# EAGLE design rs485 (EAGLE 6.5.0)
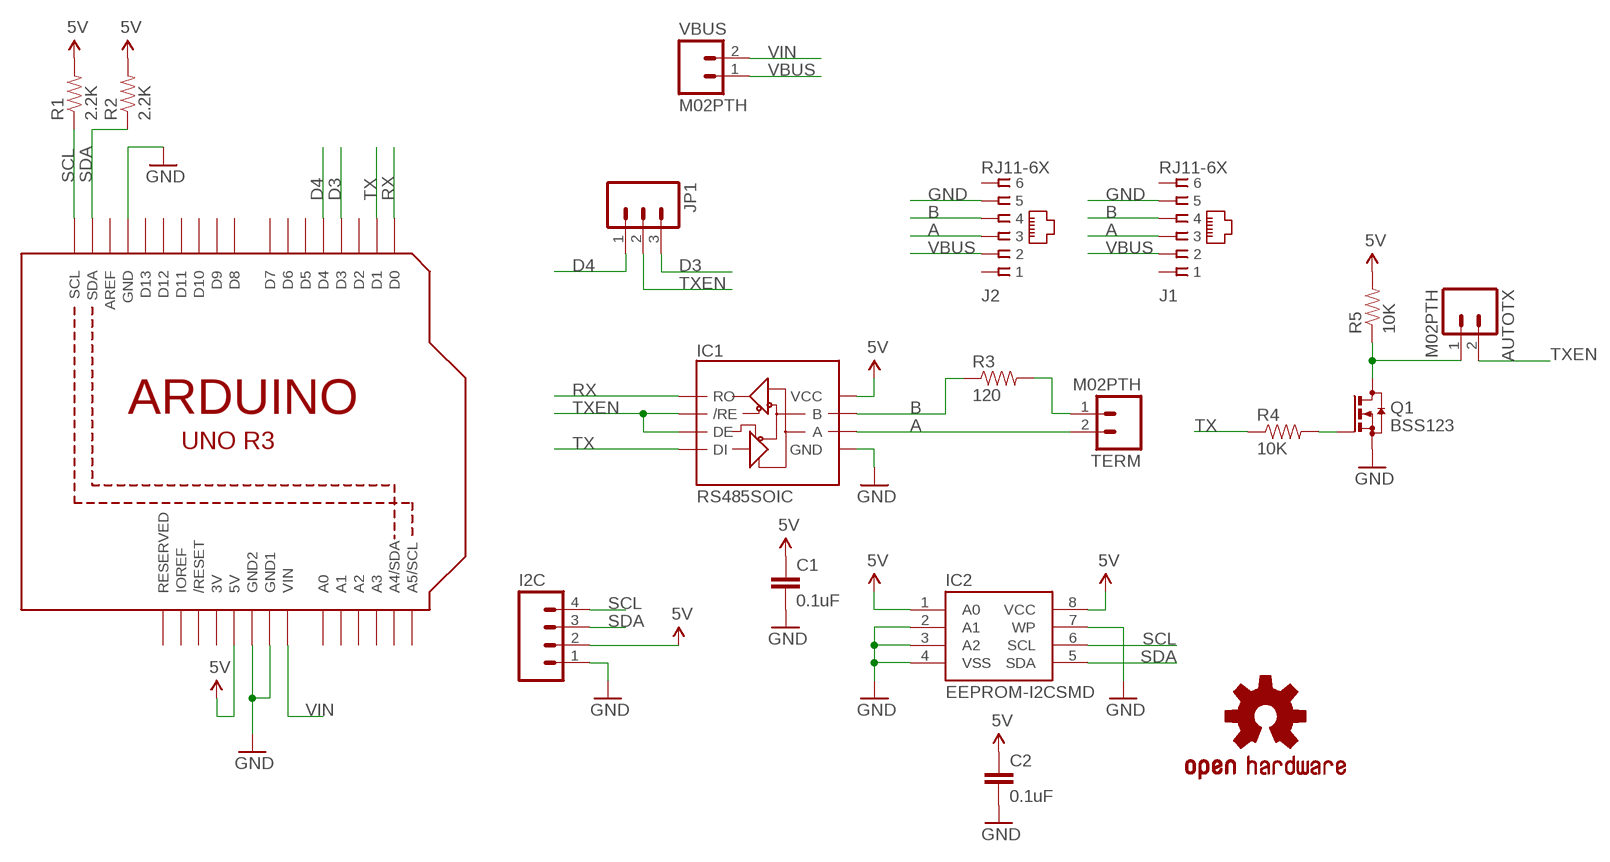
[diagram p0: schematic, sheet 1]

## Parts
AUTOTX  M02PTH  [1X02]
C1  0.1uF  CAP0603-CAP  [0603-CAP]
C2  0.1uF  CAP0603-CAP  [0603-CAP]
I2C  M04PTH  [1X04]
IC1  RS485SOIC  [SO08]
IC2  EEPROM-I2CSMD  [SO08]
J1  RJ11-6X  [RJ11-NO_SHIELD]
J2  RJ11-6X  [RJ11-NO_SHIELD]
JP1  M03PTH  [1X03]
LOGO1  OSHW-LOGOL  [OSHW-LOGO-L]
Q1  BSS123  [SOT23]
R1  2.2K  RESISTOR0603-RES  [0603-RES]
R2  2.2K  RESISTOR0603-RES  [0603-RES]
R3  120  RESISTOR0603-RES  [0603-RES]
R4  10K  RESISTOR0603-RES  [0603-RES]
R5  10K  RESISTOR0603-RES  [0603-RES]
TERM  M02PTH  [1X02]
U1  ARDUINOR3-JUSTPINS  [ARDUINOR3]
VBUS  M02PTH  [1X02]

## Nets
5V: C1.1 C2.1 I2C.2 IC1.8(VCC) IC2.1(A0) IC2.8(VCC) R1.2 R2.2 R5.2 U1.5V
A: IC1.6(A) J1.3 J2.3 TERM.2
B: IC1.7(B) J1.4 J2.4 R3.1
D3: JP1.3 U1.D3
D4: JP1.1 U1.D4
GND: C1.2 C2.2 I2C.1 IC1.5(GND) IC2.2(A1) IC2.3(A2) IC2.4(VSS) IC2.7(WP) J1.5 J2.5 Q1.2(S) U1.GND U1.GND1 U1.GND2
N$1: R3.2 TERM.1
N$2: AUTOTX.1 Q1.3(D) R5.1
N$3: Q1.1(G) R4.2
RX: IC1.1(RO) U1.D0
SCL: I2C.4 IC2.6(SCL) R1.1 U1.SCL
SDA: I2C.3 IC2.5(SDA) R2.1 U1.SDA
TX: IC1.4(DI) R4.1 U1.D1
TXEN: AUTOTX.2 IC1.2(/RE) IC1.3(DE) JP1.2
VBUS: J1.2 J2.2 VBUS.1
VIN: U1.VIN VBUS.2
Unconnected: J1.1 J1.6 J2.1 J2.6 U1.A0 U1.A1 U1.A2 U1.A3 U1.A4(A4/SDA) U1.A5(A5/SCL) U1.AREF U1.D2 U1.D5 U1.D6 U1.D7 U1.D8 U1.D9 U1.D10 U1.D11 U1.D12 U1.D13 U1.IOREF U1.RESERVED U1.RESET(/RESET)

## Power pins joined to a net without a drawn wire
3V: U1.3V

## Library data of the parts
AUTOTX TERM VBUS = SparkFun-Connectors:M02: Standard 2-pin 0.1" header. Use with - straight break away headers ( PRT-00116) - right angle break away headers (PRT-00553) - swiss pins (PRT-00743) - machine pins (PRT-00117) - female headers (PRT-00115) Molex polarized connector foot print use with: PRT-08233 with associated crimp pins and housings. 2.54_SCREWTERM for use with PRT-10571. 3.5mm Screw Terminal footprints for PRT-08084 5mm Screw Terminal footprints for use with PRT-08433
C1 C2 = SparkFun-Passives:CAP: Capacitor Standard 0603 ceramic capacitor, and 0.1" leaded capacitor.
I2C = SparkFun-Connectors:M04: Header 4 Standard 4-pin 0.1" header. Use with straight break away headers (SKU : PRT-00116), right angle break away headers (PRT-00553), swiss pins (PRT-00743), machine pins (PRT-00117), and female headers (PRT-00115). Molex polarized connector foot print use with SKU : PRT-08231 with associated crimp pins and housings. 1MM SMD Version SKU: PRT-10208
IC1 = SparkFun-DigitalIC:RS485: RS485 transceiver
IC2 = SparkFun-DigitalIC:EEPROM-I2C: I2C EEPROM chips, 24LC256 (and others)
J1 J2 = con-tycoelectronics:RJ11: CORCOM Modular RJ Jacks No Shield Source: www.tycoelectronics.com .. ENG_DS_1654001_1099_RJ_L_0507.pdf; MPN: RJ11-6X; OC_FARNELL: unknown; OC_NEWARK: 16R6089
JP1 = SparkFun-Connectors:M03: Header 3 Standard 3-pin 0.1" header. Use with straight break away headers (SKU : PRT-00116), right angle break away headers (PRT-00553), swiss pins (PRT-00743), machine pins (PRT-00117), and female headers (PRT-00115). Molex polarized connector foot print use with SKU : PRT-08232 with associated crimp pins and housings.
LOGO1 = SparkFun-Aesthetics:OSHW-LOGO: Open Source Hardware Logo This logo indicates the piece of hardware it is found on incorporates a OSHW license and/or adheres to the definition of open source hardware found here: http://freedomdefined.org/OSHW
Q1 = transistor-small-signal:BSS123: N-CHANNEL MOS FET
R1-R5 = SparkFun-Passives:RESISTOR: Resistor Basic schematic elements and footprints for 0603, 1206, and PTH resistors.
U1 = arduino-pins:ARDUINOR3: This is a new object for the new Arduino R3 - with extra pins that you may want to use (such as IOref, and duplicated A4/A5

## Board
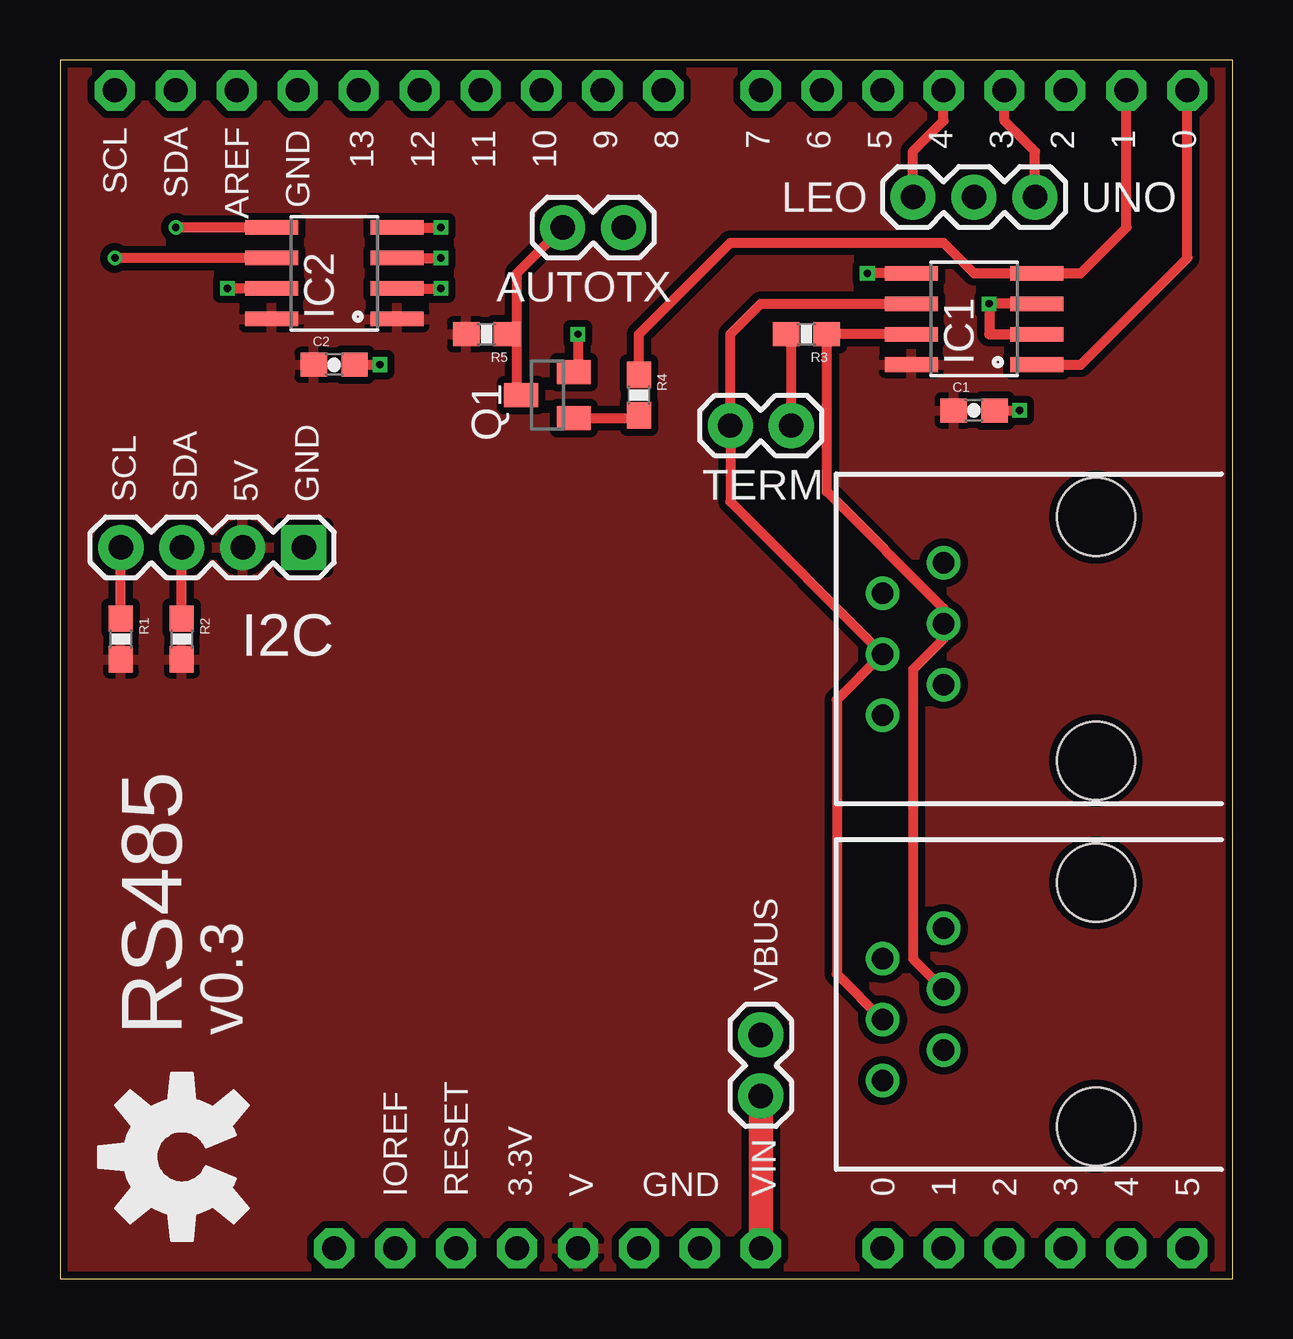
[diagram p1: board, top side]
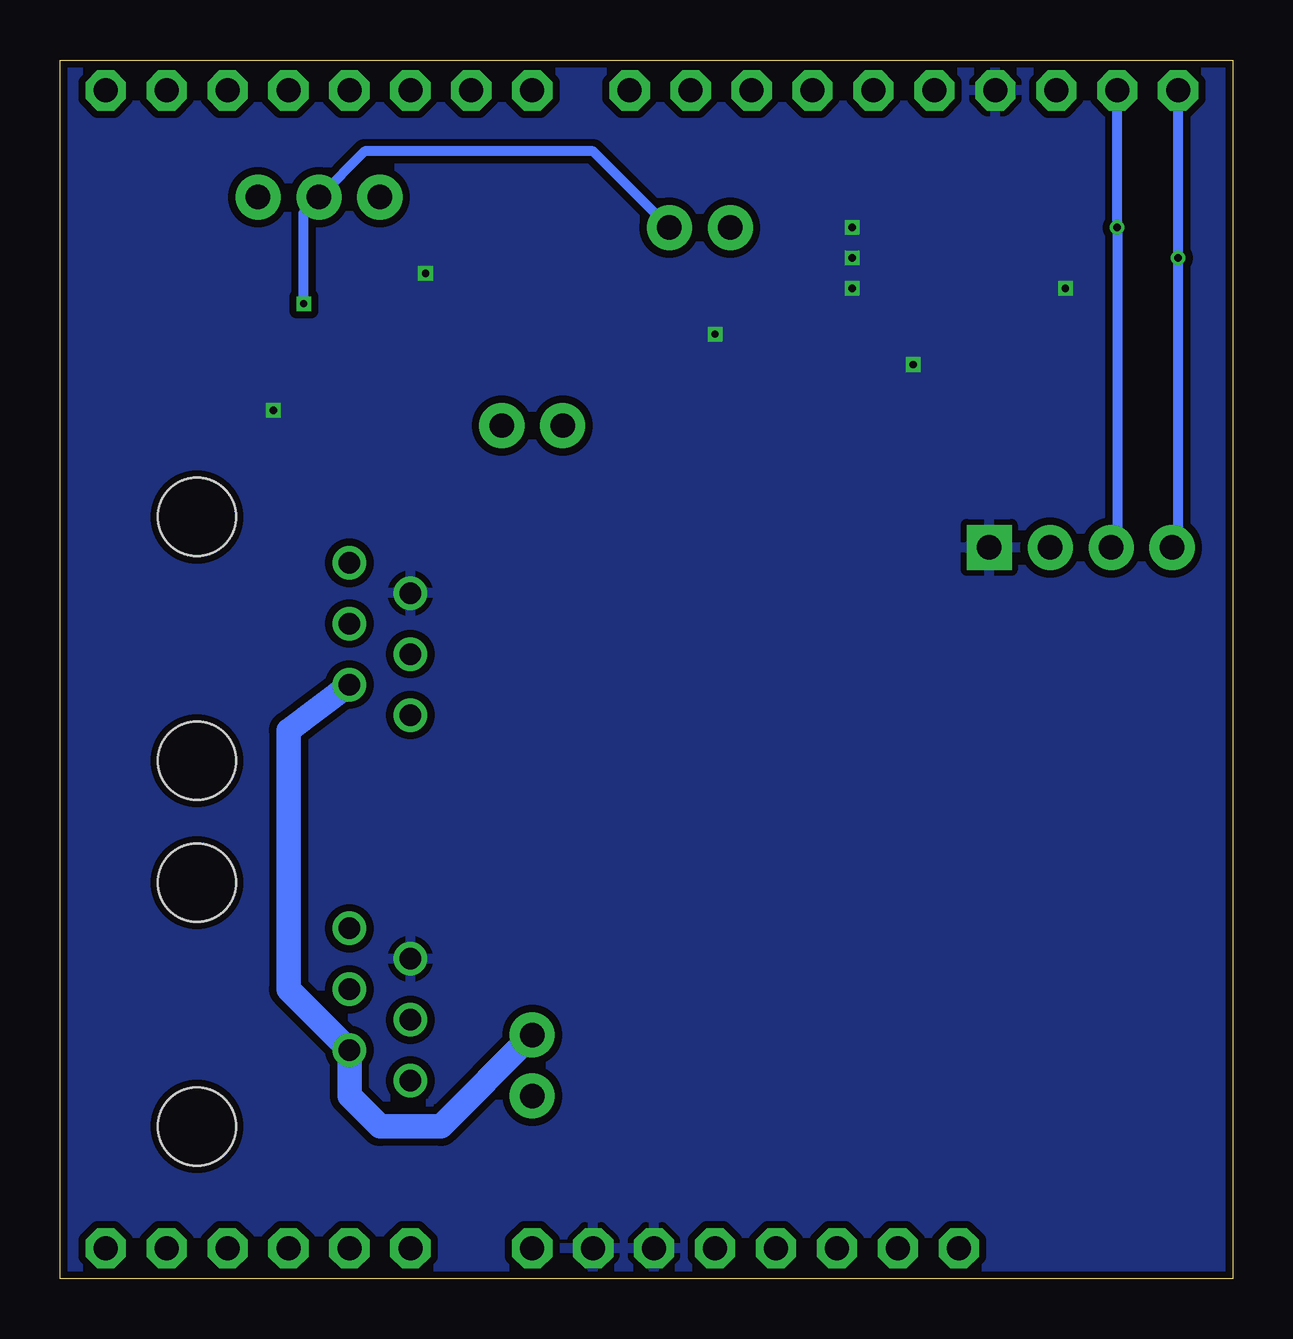
[diagram p2: board, bottom side, seen from below]

Size 48.9 x 50.8 mm. Coordinates in mm from the lower left corner, seen from the top.
Outline: 0,0 48.9,0 48.9,50.8 0,50.79 0,0
Copper layers (1*2*15*16): Top 0.035mm / dielectric 0.2mm / Route2 0.0175mm / dielectric 1.1mm / Route15 0.0175mm / dielectric 0.2mm / Bottom 0.035mm
Design rules "SeeedStudio_DRU_no_angle_20130527": minimum track width 6mil, minimum drill 12mil, track to track 6mil, track to pad 6mil, pad to pad 6mil, via to via 6mil, smd to smd 0mil, copper to edge 10mil, drill to drill 10mil, minimum pad ring 6mil, minimum via ring 6mil, stop-mask expansion 2mil, vias tented up to drill 25mil, thermal gap 10mil

### Footprints (pad centres in the part's own frame; a part is rotated, then mirrored left to right if it is on the bottom)
1X02 = drill 1.016 pad 1.88: 1 0,0; 2 2.54,0
0603-CAP = smd 1.1 x 1: 1 -0.85,0; 2 0.85,0
1X04 = drill 1.016 pad 1.88 square: 1 0,0 | drill 1.016 pad 1.88: 2 2.54,0; 3 5.08,0; 4 7.62,0
SO08 = smd 0.61 x 2.21: 1 -1.905,-2.616; 2 -0.635,-2.616; 3 0.635,-2.616; 4 1.905,-2.616; 5 1.905,2.616; 6 0.635,2.616; 7 -0.635,2.616; 8 -1.905,2.616
RJ11-NO_SHIELD = drill 0.9 pad 1.4: 1 -3.175,8.89; 2 -1.905,6.35; 3 -0.635,8.89; 4 0.635,6.35; 5 1.905,8.89; 6 3.175,6.35 | hole 3.251: -5.08,0; 5.08,0
1X03 = drill 1.016 pad 1.88: 1 0,0; 2 2.54,0; 3 5.08,0
SOT23 = smd 1 x 1.4: 1 -0.95,-1.1; 2 0.95,-1.1; 3 0,1.1
0603-RES = smd 1.1 x 1: 1 -0.85,0; 2 0.85,0
ARDUINOR3 = drill 1 pad 1.676 octagon: 3V 19.05,1.27; 5V 21.59,1.27; A0 34.29,1.27; A1 36.83,1.27; A2 39.37,1.27; A3 41.91,1.27; A4 44.45,1.27; A5 46.99,1.27; AREF 7.366,49.53; D0 46.99,49.53; D1 44.45,49.53; D2 41.91,49.53; D3 39.37,49.53; D4 36.83,49.53; D5 34.29,49.53; D6 31.75,49.53; D7 29.21,49.53; D8 25.146,49.53; D9 22.606,49.53; D10 20.066,49.53; D11 17.526,49.53; D12 14.986,49.53; D13 12.446,49.53; GND 9.906,49.53; GND1 26.67,1.27; GND2 24.13,1.27; IOREF 13.97,1.27; RESERVED 11.43,1.27; RESET 16.51,1.27; SCL 2.286,49.53; SDA 4.826,49.53; VIN 29.21,1.27

### Placement (x,y rotation side)
AUTOTX  20.95,43.81 0 top
C1  38.1,36.2 0 top
C2  11.43,38.1 0 top
I2C  10.16,30.48 180 top
IC1  38.1,40.01 90 top
IC2  11.43,41.91 90 top
J1  43.18,26.67 90 top
J2  43.18,11.43 90 top
JP1  35.56,45.09 0 top
LOGO1  5.08,5.08 90 top
Q1  20.32,36.83 90 top
R1  2.54,26.67 270 top
R2  5.08,26.67 270 top
R3  31.11,39.37 180 top
R4  24.13,36.83 270 top
R5  17.78,39.37 180 top
TERM  30.48,35.56 180 top
U1  0,0 0 top
VBUS  29.21,10.16 270 top

### Tracks (layer width: path | path; a pad name or v marks a point on that pad's centre or on a via)
5V
  pour Top (isolate 0.305): 0,0 0,50.8 48.9,50.8 48.9,0
A
  Top 0.406: IC1.6 29.21,40.64 27.94,39.37 TERM.2 27.94,32.38 J1.3 32.38,24.13 32.38,12.7 J2.3
B
  Top 0.406: IC1.7 R3.1 31.96,32.8 36.83,27.94 J1.4 36.83,26.67 35.56,25.4 35.56,13.34 J2.4
D3
  Top 0.406: JP1.3 40.64,46.99 39.37,48.26 U1.D3
D4
  Top 0.406: JP1.1 35.56,46.99 36.83,48.26 U1.D4
GND  (via drill 0.3)
  Top 0.406: C2.2 v13.34,38.1 | IC2.4 v15.88,43.81 | IC2.3 v15.88,42.55 | IC2.2 v15.88,41.27 | IC2.7 v6.99,41.27 | C1.2 v40.01,36.2 | IC1.5 v33.66,41.91 | v21.59,39.37 21.59,37.95 Q1.2
  pour Bottom (isolate 0.305): 0,0 0,50.8 48.9,50.8 48.9,0
N$1
  Top 0.406: TERM.1 30.48,39.16 R3.2
N$2
  Top 0.406: 19.05,39.37 19.05,36.83 Q1.3 | 19.05,39.37 19.05,41.91 AUTOTX.1 | R5.1 19.05,39.37
N$3
  Top 0.406: Q1.1 24.13,35.88 R4.2
RX
  Top 0.406: IC1.1 42.55,38.1 46.99,42.55 U1.D0
SCL  (via drill 0.3)
  Top 0.406: R1.1 I2C.4 | IC2.6 v2.29,42.55
  Bottom 0.406: I2C.4 2.29,30.86 v2.29,42.55 U1.SCL
SDA  (via drill 0.3)
  Top 0.406: R2.1 I2C.3 | IC2.5 v4.83,43.81
  Bottom 0.406: U1.SDA v4.83,43.81 4.83,30.73 I2C.3
TX
  Top 0.406: U1.D1 44.45,43.81 42.55,41.91 IC1.4 38.1,41.91 36.83,43.18 27.94,43.18 24.13,39.37 R4.1
TXEN  (via drill 0.3)
  Top 0.406: IC1.2 38.73,39.37 v38.73,40.64 IC1.3
  Bottom 0.406: v38.73,40.64 38.73,44.45 JP1.2 36.2,46.99 26.67,46.99 AUTOTX.2
VBUS
  Bottom 1.016: J1.2 39.37,22.86 39.37,12.06 J2.2 36.83,7.62 35.56,6.35 33.02,6.35 VBUS.1
VIN
  Top 1.016: U1.VIN VBUS.2

### Text on the board
tPlace: LEO | UNO | SCL | SDA | 5V | GND | RS485 | v0.3